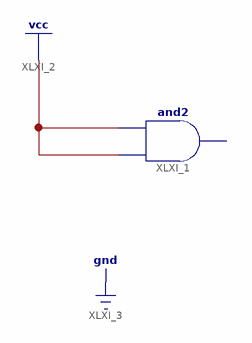
[diagram p0: schematic sheet 1]
// Xilinx ISE schematic compuertas.sch (artix7) as structural Verilog: 1 symbols, 0 ports
module compuertas (
);

  // and2 XLXI_1 has open pins: I0=1'b1, I1=1'b1, O=open
endmodule
